# EAGLE schematic powerSchematic v6 (EAGLE 9.7.0)
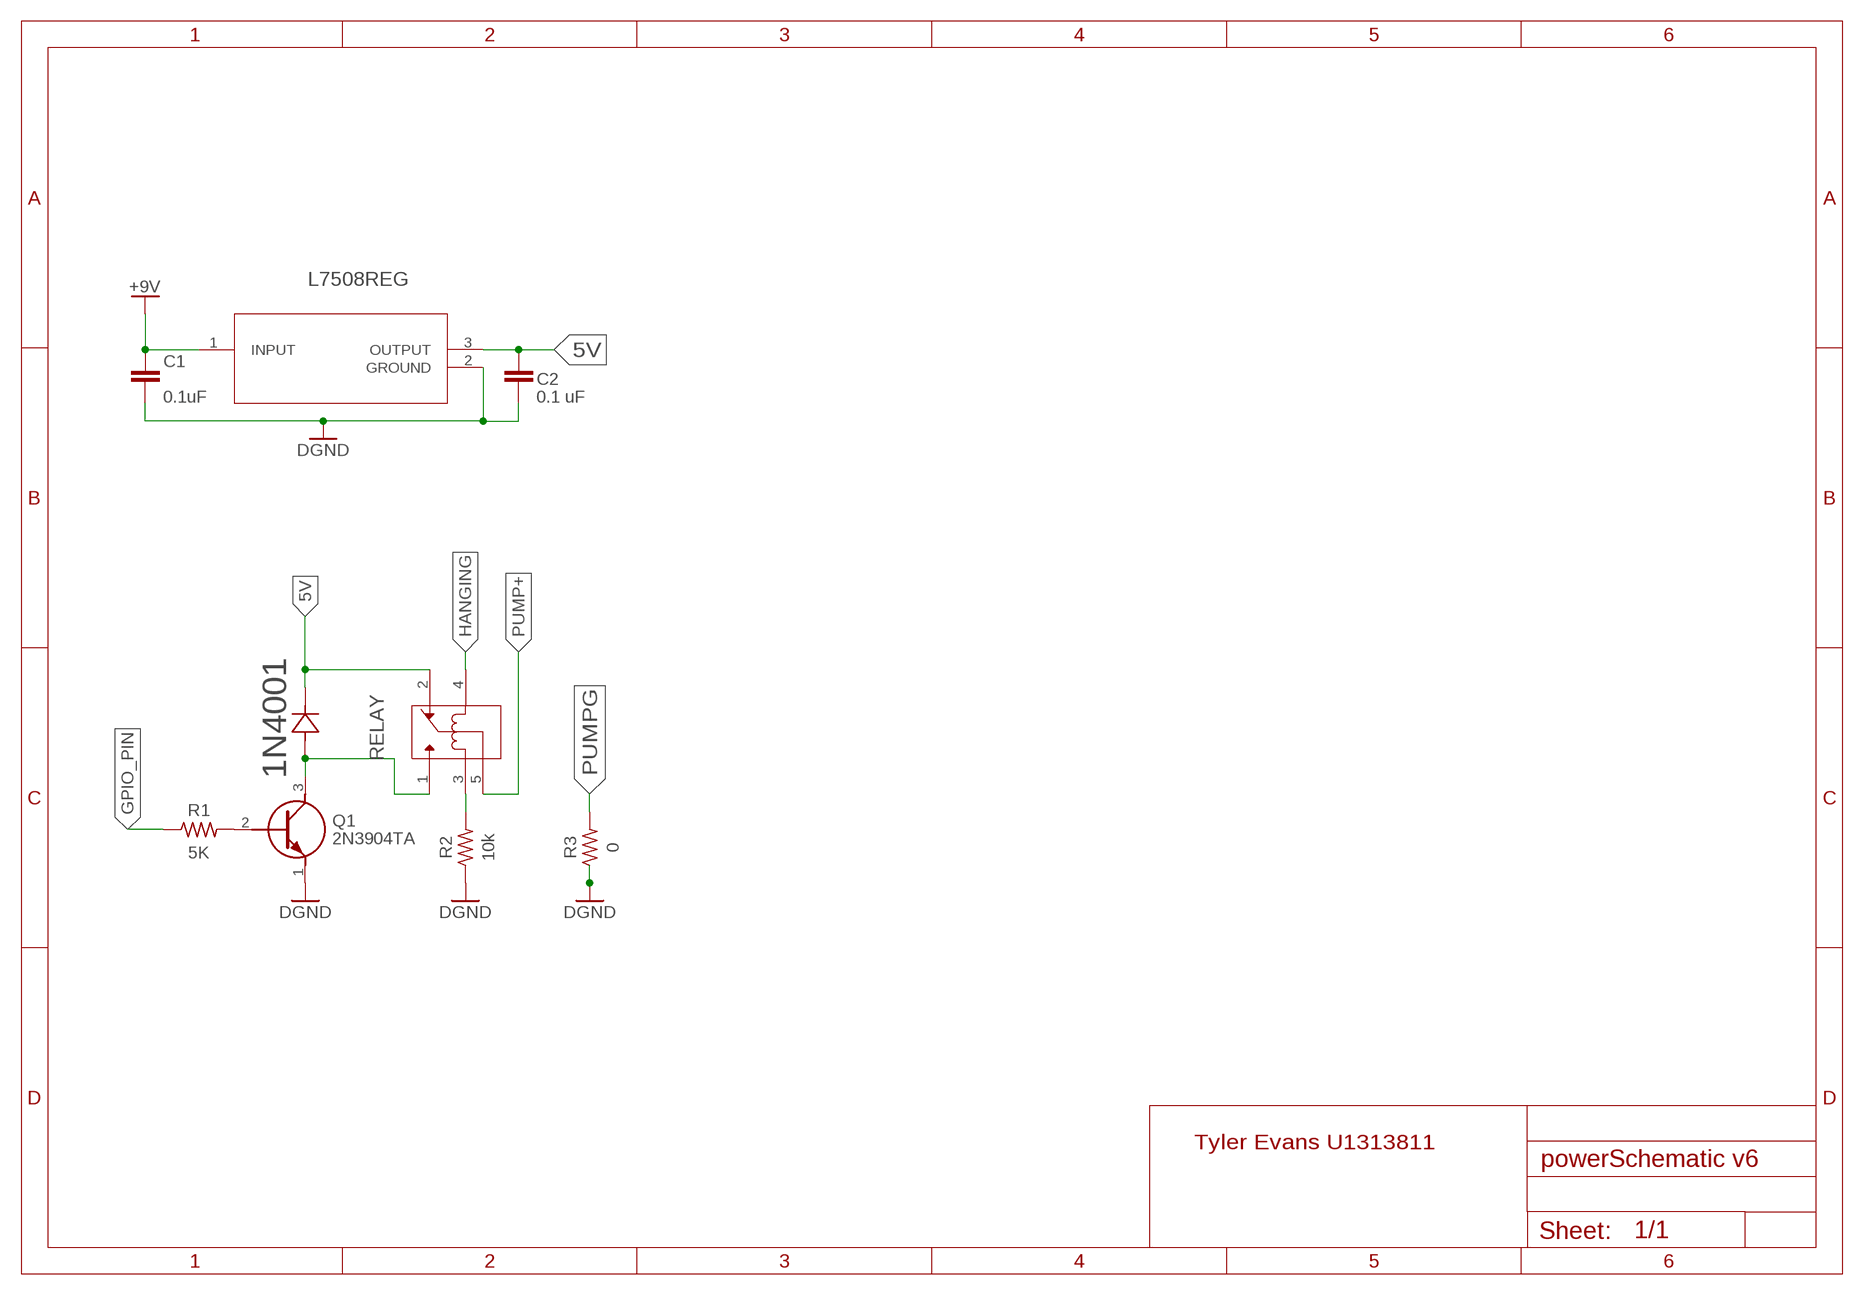
[diagram p0: schematic, sheet 1]

## Parts
1N4001  1N4001G-TDO-41_DIO  [DO-41_DIO]
C1  0.1uF  C_RADIAL-55.5MM-DIA  [CAPRD2261W240D5080H5555B]
C2  0.1 uF  C_RADIAL-55.5MM-DIA  [CAPRD2261W240D5080H5555B]
L7508REG  L7805ACVTO-220_STM  [TO-220_STM]
Q1  2N3904TA  [BC33740TA]
R1  5K  R-US_AXIAL-7.2MM-PITCH  [RESAD724W46L381D178B]
R2  10k  R-US_AXIAL-7.2MM-PITCH  [RESAD724W46L381D178B]
R3  0  R-US_AXIAL-7.2MM-PITCH  [RESAD724W46L381D178B]
RELAY  ORWH-SH-105D1F,000RELAY_1-1721150-0_TEC  [RELAY_1-1721150-0_TEC]

## Nets
5V: 1N4001.1 C2.1 L7508REG.3(OUTPUT) R2.2 RELAY.2 RELAY.3
+9V: C1.1 L7508REG.1(INPUT)
DGND: C1.2 C2.2 L7508REG.2(GROUND) Q1.1(E) R2.1 R3.1
GPIO_PIN: R1.1
HANGING: RELAY.4
N$1: Q1.2(B) R1.2
N$2: 1N4001.2 Q1.3(C) RELAY.1
PUMP+: RELAY.5
PUMPG: R3.2

## Notes on the sheet
- Tyler Evans U1313811
- Tyler Evans U1313811

## Library data of the parts
1N4001 = 2024-03-26_04-44-08_Library:1N4001G-T; COPYRIGHT: Copyright (C) 2024 Ultra Librarian. All rights reserved.; MANUFACTURER_PART_NUMBER: 1N4001G-T; MFR_NAME: Diodes Inc
C1 C2 = Tutorial - Fusion 360:C: Capacitor - Generic; CATEGORY: Capacitor
L7508REG = 2024-03-26_04-52-56_Library:L7805ACV; COPYRIGHT: Copyright (C) 2024 Ultra Librarian. All rights reserved.; MANUFACTURER_PART_NUMBER: L7805ACV; MFR_NAME: STMicroelectronics
Q1 = 2N3904TA:2N3904TA: Transistor GP BJT NPN 40V 0.2A TO92-3 Source: Datasheet <http://www.onsemi.com/pub/Collateral/2N3904-D.pdf>; DESCRIPTION: Transistor GP BJT NPN 40V 0.2A TO92-3; HEIGHT: mm; MANUFACTURER_NAME: onsemi; MANUFACTURER_PART_NUMBER: 2N3904TA; MOUSER_PART_NUMBER: 512-2N3904TA; MOUSER_PRICE-STOCK: https://www.mouser.co.uk/ProductDetail/onsemi-Fairchild/2N3904TA?qs=ljbEvF4DwOOn1Ev%2FzRYaoA%3D%3D
R1-R3 = Resistor:R-US: Resistor Fixed - ANSI; CATEGORY: Resistor; SUB-CATEGORY: Fixed
RELAY = 2024-03-26_05-25-01_Library:ORWH-SH-105D1F,000; COPYRIGHT: Copyright (C) 2024 Ultra Librarian. All rights reserved.; MANUFACTURER_PART_NUMBER: ORWH-SH-105D1F,000; MFR_NAME: TE Connectivity